# EAGLE design incrementeur3b (EAGLE 6.3)
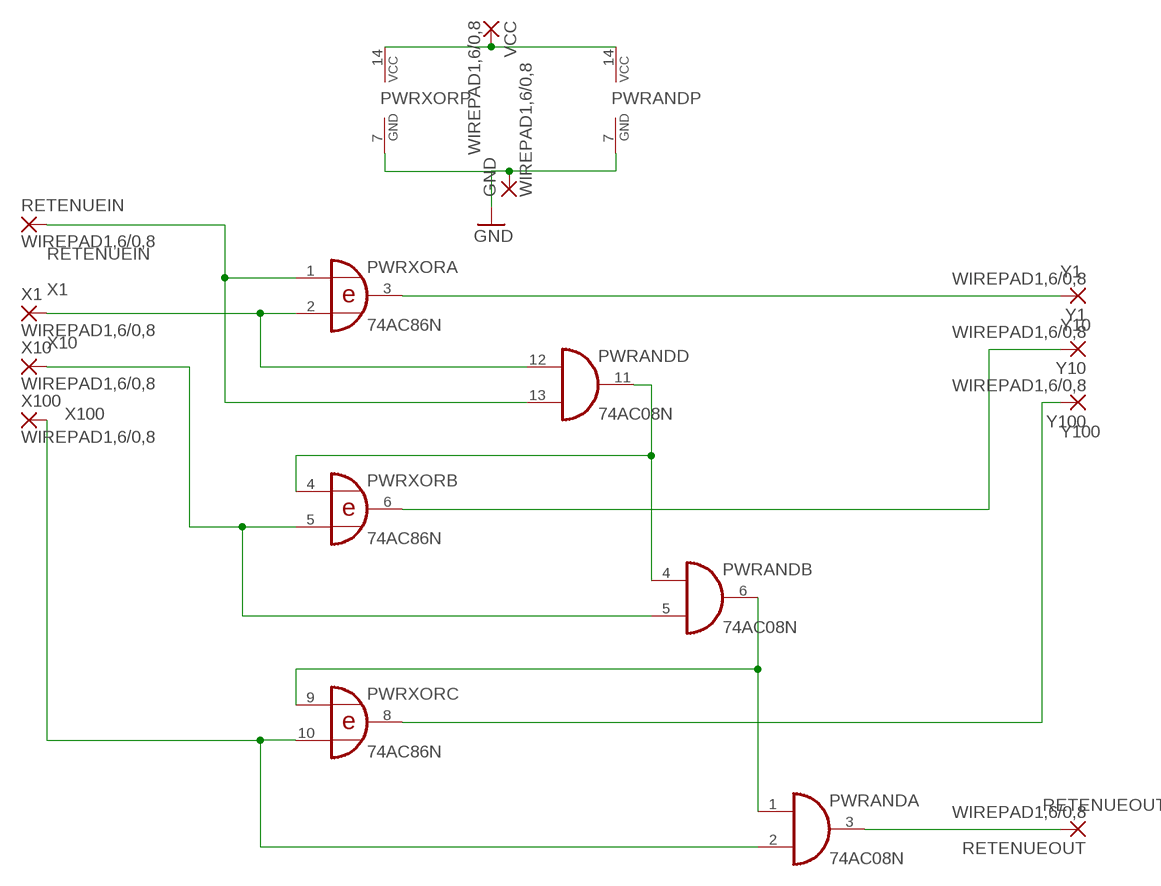
[diagram p0: schematic, sheet 1]

## Parts
GND  WIREPAD1,6/0,8  [1,6/0,8]
PWRAND  74AC08N  [DIL14]
PWRXOR  74AC86N  [DIL14]
RETENUEIN  WIREPAD1,6/0,8  [1,6/0,8]
RETENUEOUT  WIREPAD1,6/0,8  [1,6/0,8]
VCC  WIREPAD1,6/0,8  [1,6/0,8]
X1  WIREPAD1,6/0,8  [1,6/0,8]
X10  WIREPAD1,6/0,8  [1,6/0,8]
X100  WIREPAD1,6/0,8  [1,6/0,8]
Y1  WIREPAD1,6/0,8  [1,6/0,8]
Y10  WIREPAD1,6/0,8  [1,6/0,8]
Y100  WIREPAD1,6/0,8  [1,6/0,8]

## Nets
GND: GND.1(P) PWRAND.7(P:GND) PWRXOR.7(P:GND)
N$1: PWRAND.14(P:VCC) PWRXOR.14(P:VCC) VCC.1(P)
N$4: PWRAND.4(B:I0) PWRAND.11(D:O) PWRXOR.4(B:I0)
N$5: PWRAND.1(A:I0) PWRAND.6(B:O) PWRXOR.9(C:I0)
RETENUEIN: PWRAND.13(D:I1) PWRXOR.1(A:I0) RETENUEIN.1(P)
RETENUEOUT: PWRAND.3(A:O) RETENUEOUT.1(P)
X1: PWRAND.12(D:I0) PWRXOR.2(A:I1) X1.1(P)
X10: PWRAND.5(B:I1) PWRXOR.5(B:I1) X10.1(P)
X100: PWRAND.2(A:I1) PWRXOR.10(C:I1) X100.1(P)
Y1: PWRXOR.3(A:O) Y1.1(P)
Y10: PWRXOR.6(B:O) Y10.1(P)
Y100: PWRXOR.8(C:O) Y100.1(P)
Unconnected: PWRAND.8(C:O) PWRAND.9(C:I0) PWRAND.10(C:I1) PWRXOR.11(D:O) PWRXOR.12(D:I0) PWRXOR.13(D:I1)

## Library data of the parts
GND RETENUEIN RETENUEOUT VCC X1 X10 X100 Y1 Y10 Y100 = wirepad:WIREPAD: Wire PAD connect wire on PCB
PWRAND = 74xx-eu:74*08: Quad 2-input AND gate
PWRXOR = 74xx-eu:74*86: Quad 2-input EXCLUSIVE-OR (XOR) gate

## Board
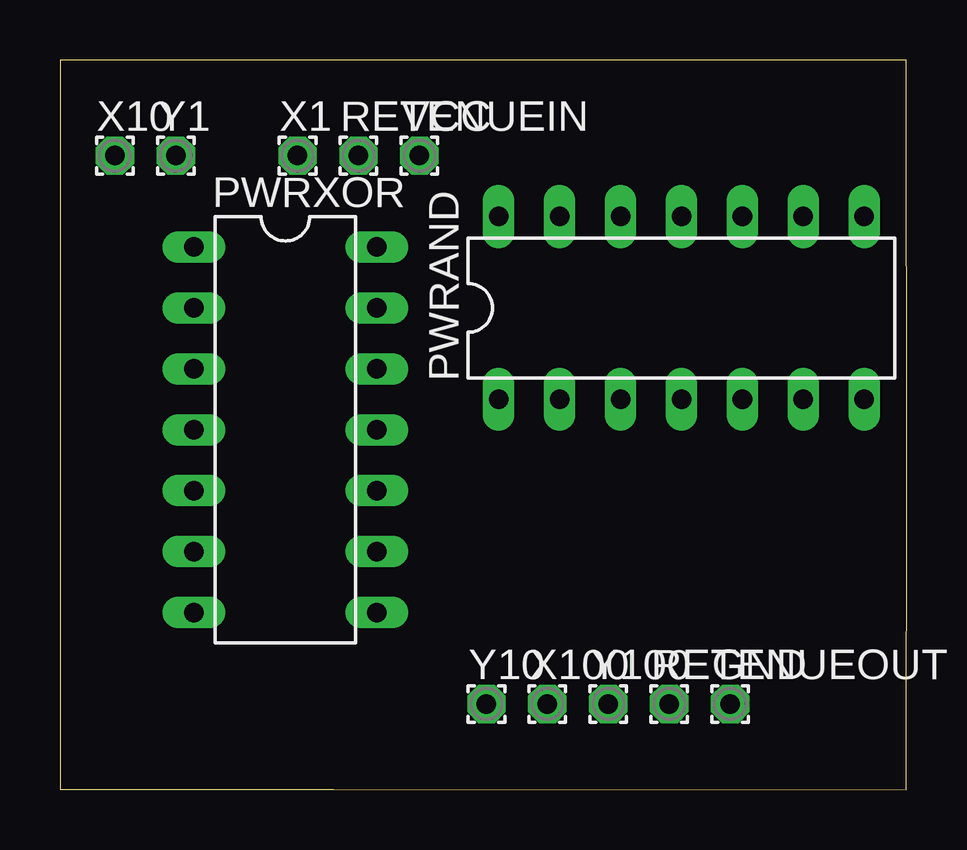
[diagram p1: board, top side]
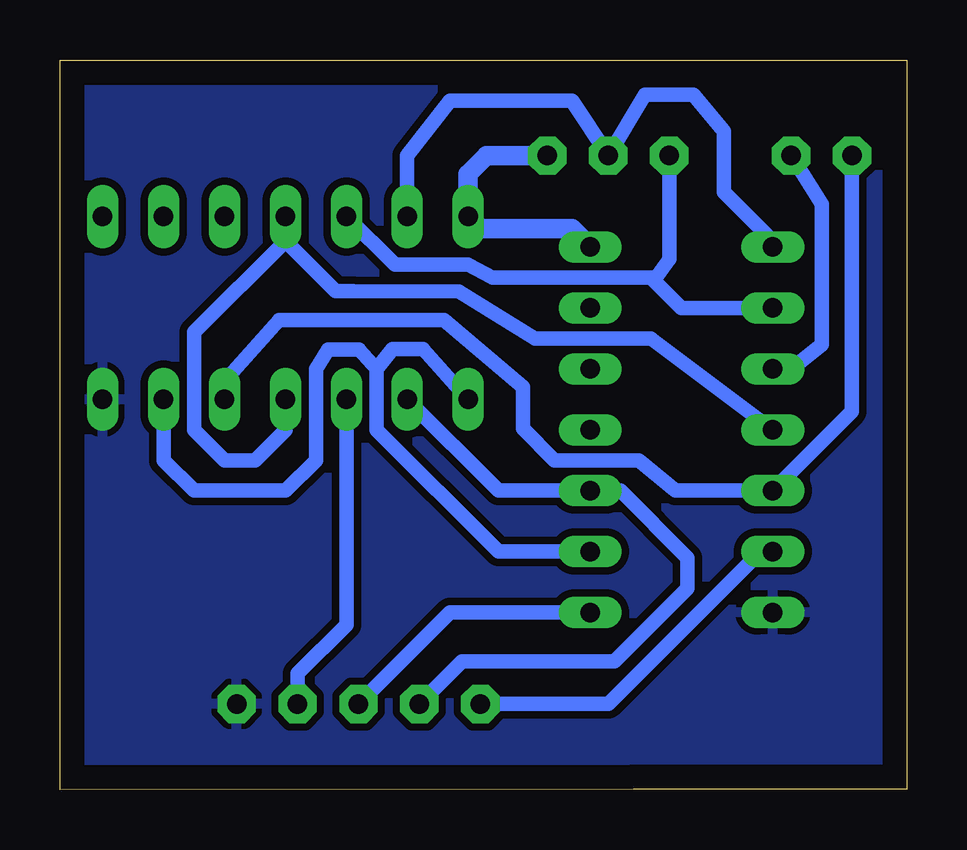
[diagram p2: board, bottom side, seen from below]

Size 35.31 x 30.42 mm. Coordinates in mm from the lower left corner, seen from the top.
Outline: 0,0.02 11.41,0.02 35.29,0 35.31,13.23 35.29,30.42 0,30.42 0,0.02
Copper layers (1*16): Top 0.035mm / dielectric 1.5mm / Bottom 0.035mm
Design rules "default *": minimum track width 10mil, minimum drill 24mil, track to track 12mil, track to pad 12mil, pad to pad 12mil, via to via 12mil, smd to smd 12mil, copper to edge 40mil, drill to drill 12mil, minimum pad ring 10mil, minimum via ring 8mil, stop-mask expansion 4mil, vias tented up to drill 0mil, thermal gap 10mil

### Footprints (pad centres in the part's own frame; a part is rotated, then mirrored left to right if it is on the bottom)
1,6/0,8 = drill 0.813 pad 1.6 octagon: 1 0,0
DIL14 = drill 0.813 long: 1 -7.62,-3.81; 2 -5.08,-3.81; 3 -2.54,-3.81; 4 0,-3.81; 5 2.54,-3.81; 6 5.08,-3.81; 7 7.62,-3.81; 8 7.62,3.81; 9 5.08,3.81; 10 2.54,3.81; 11 0,3.81; 12 -2.54,3.81; 13 -5.08,3.81; 14 -7.62,3.81

### Placement (x,y rotation side)
GND  27.94,3.58 0 top
PWRAND  25.91,20.09 0 top
PWRXOR  9.4,15.01 270 top
RETENUEIN  12.45,26.44 0 top
RETENUEOUT  25.4,3.58 0 top
VCC  14.99,26.44 0 top
X1  9.91,26.44 0 top
X10  2.29,26.44 0 top
X100  20.32,3.58 0 top
Y1  4.83,26.44 0 top
Y10  17.78,3.58 0 top
Y100  22.86,3.58 0 top

### Tracks (layer width: path | path; a pad name or v marks a point on that pad's centre or on a via)
GND
  pour Bottom: -0.25,30.5 35.31,30.5 35.31,-0.23 -0.25,-0.23
N$1
  Bottom 0.813: VCC.1 17.53,26.44 18.29,25.67 PWRAND.14 17.78,23.39 13.97,23.39 PWRXOR.14
N$4
  Bottom 0.61: PWRXOR.4 10.67,18.82 15.49,18.82 18.67,20.78 23.09,20.8 23.82,20.8 25.91,22.88 | PWRAND.4 25.91,15.01 27.18,13.74 28.45,13.74 29.72,15.01 29.72,19.07 25.91,22.88 | 25.91,23.62 PWRAND.11 25.91,22.88
N$5
  Bottom 0.61: PWRAND.1 20.17,18.38 21.44,18.38 22.1,17.55 | 22.1,17.55 22.1,15.01 17.02,9.93 PWRXOR.9 | 22.1,17.55 22.84,18.36 23.57,18.36 24.13,18.35 24.64,17.55 24.64,13.74 25.91,12.47 29.72,12.47 30.99,13.74 PWRAND.6
RETENUEIN
  Bottom 0.61: PWRXOR.1 5.59,22.88 7.62,24.91 7.62,27.45 8.89,28.98 10.92,28.98 RETENUEIN.1 13.97,28.72 19.05,28.72 20.83,26.44 PWRAND.13
RETENUEOUT
  Bottom 0.61: RETENUEOUT.1 25.4,4.85 23.37,6.88 PWRAND.3
X1
  Bottom 0.61: PWRXOR.2 9.4,20.09 10.54,21.23 | 10.54,21.23 10.67,21.36 17.27,21.36 18.29,21.9 21.34,21.9 PWRAND.12 | X1.1 9.91,22.12 10.54,21.23
X10
  Bottom 0.61: PWRAND.5 28.45,17.04 26.16,19.58 19.3,19.58 16,16.78 16,15.05 14.69,13.74 11.18,13.74 9.65,12.47 PWRXOR.5 2.29,15.77 X10.1
X100
  Bottom 0.61: PWRAND.2 17.02,12.47 PWRXOR.10 11.94,12.47 9.14,9.67 9.14,8.4 12.19,5.35 18.54,5.35 X100.1
Y1
  Bottom 0.61: PWRXOR.3 4.83,17.55 3.56,18.56 3.56,24.4 Y1.1
Y10
  Bottom 0.61: PWRXOR.6 6.1,9.93 12.45,3.58 Y10.1
Y100
  Bottom 0.61: PWRXOR.8 19.05,7.39 Y100.1